# EAGLE design E-P-099-R2.8 (EAGLE 9.0.1)
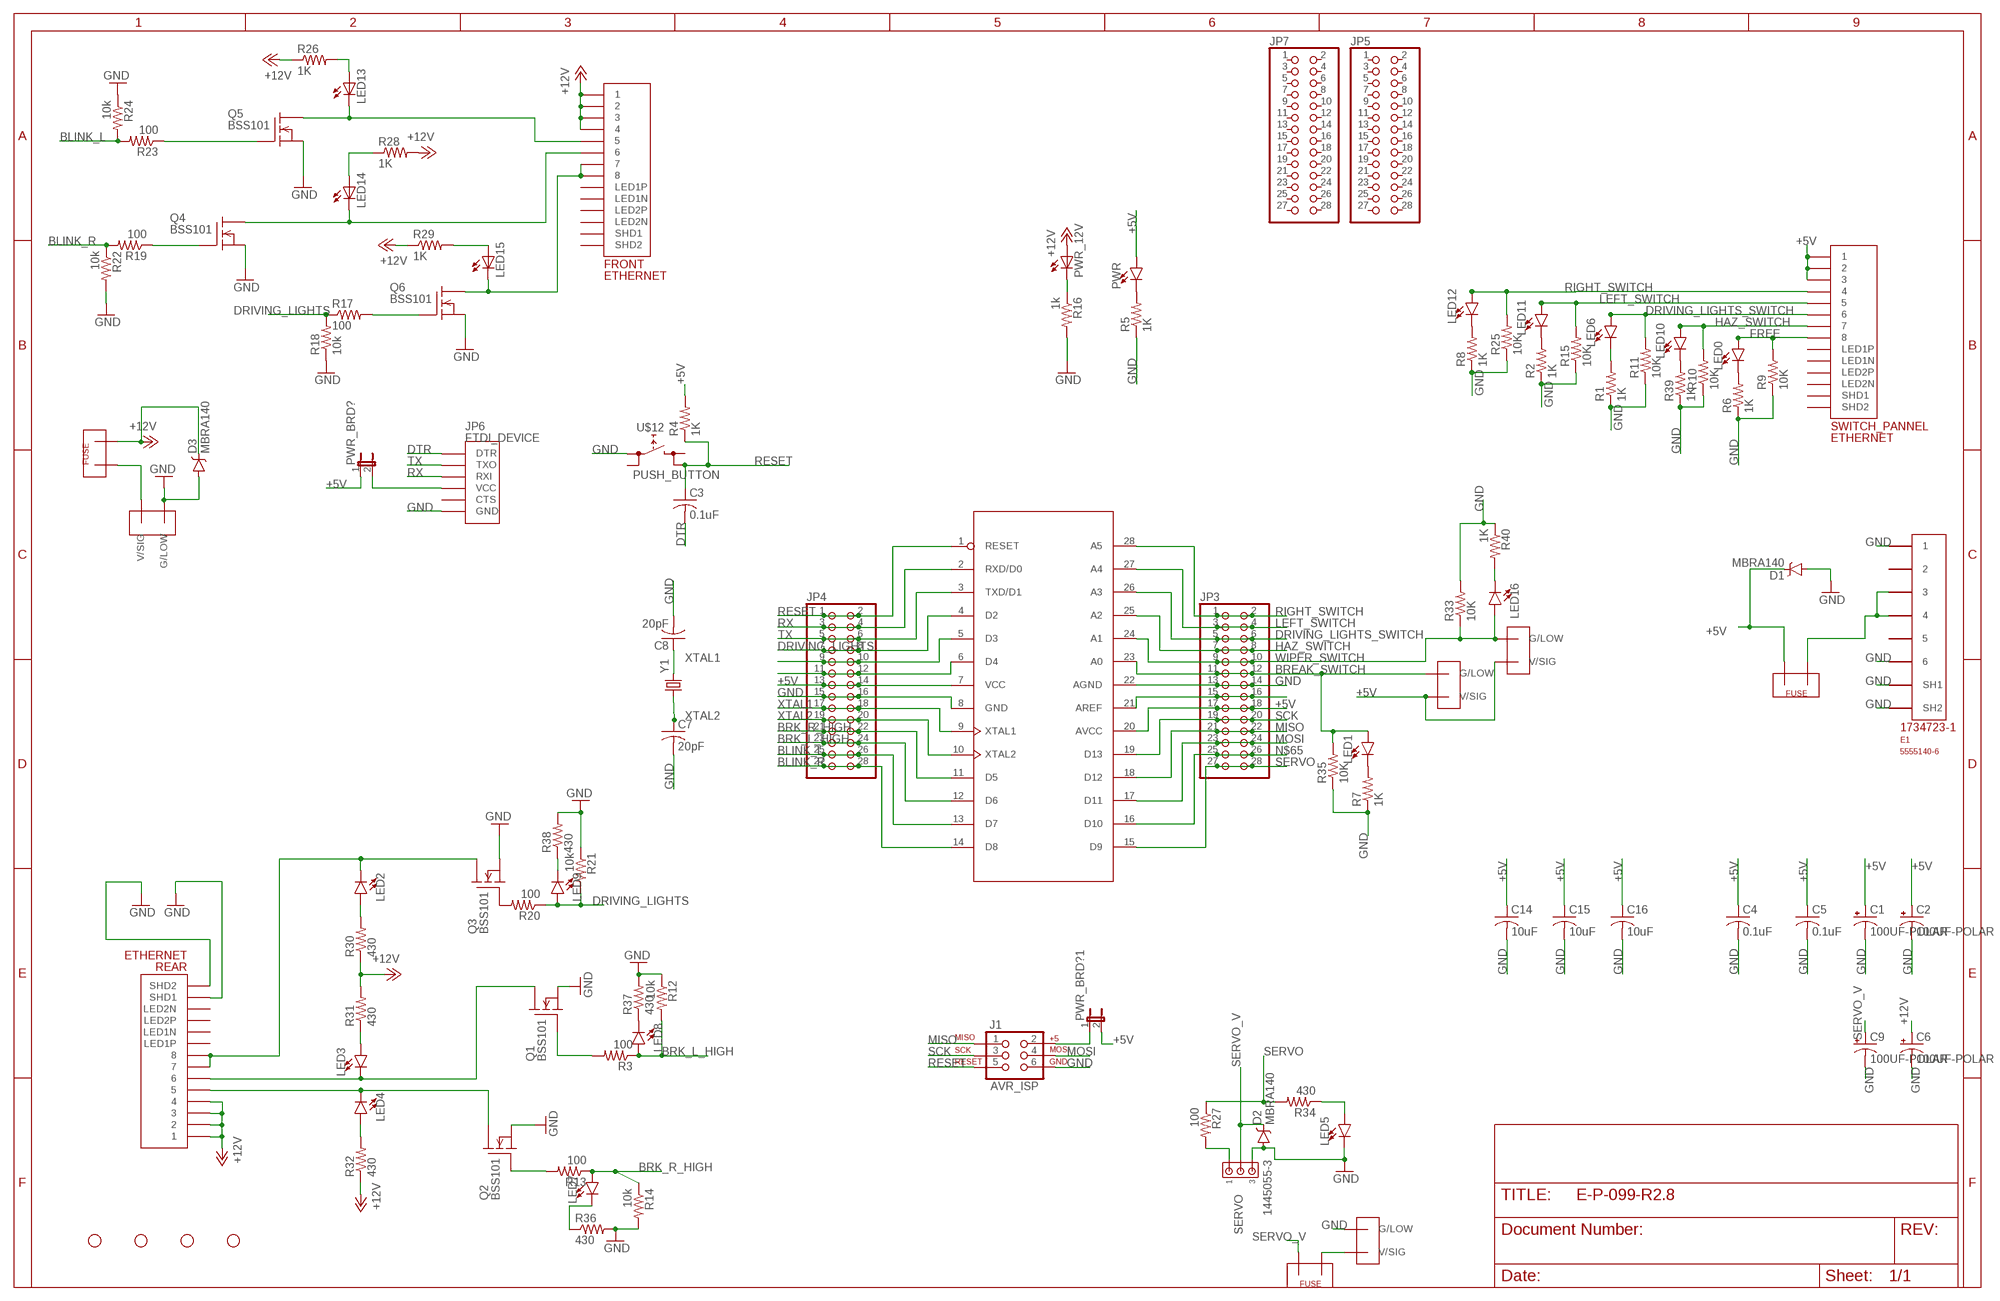
[diagram p0: schematic, sheet 1]

## Parts
C1  100UF-POLAR  [EEU-FR1H101]
C2  100UF-POLAR  [EEU-FR1H101]
C3  0.1uF  C-USC0805  [C0805]
C4  0.1uF  C-USC0805  [C0805]
C5  0.1uF  C-USC0805  [C0805]
C6  100UF-POLAR  [EEU-FR1H101]
C7  20pF  C-USC0805  [C0805]
C8  20pF  C-USC0805  [C0805]
C9  100UF-POLAR  [EEU-FR1H101]
C14  10uF  C-USC0805  [C0805]
C15  10uF  C-USC0805  [C0805]
C16  10uF  C-USC0805  [C0805]
D1  MBRA140  [SMA-DIODE]
D2  MBRA140  [SMA-DIODE]
D3  MBRA140  [SMA-DIODE]
E1  5555140-6  [1734723-1_RJ11]
FRONT  ETHERNET  [A122645-ND]
J1  AVR_ISP  AVR_SPI_PRG_6PTH  [2X3]
JP3  PINHD-2X14  [2X14]
JP4  PINHD-2X14  [2X14]
JP5  PINHD-2X14  [2X14]
JP6  FTDI_DEVICE  [FTDI_DEVICE_SIDE]
JP7  PINHD-2X14  [2X14]
LED0  LED0603  [LED-0603]
LED1  LED0603  [LED-0603]
LED2  LED0603  [LED-0603]
LED3  LED0603  [LED-0603]
LED4  LED0603  [LED-0603]
LED5  LED0603  [LED-0603]
LED6  LED0603  [LED-0603]
LED7  LED0603  [LED-0603]
LED8  LED0603  [LED-0603]
LED9  LED0603  [LED-0603]
LED10  LED0603  [LED-0603]
LED11  LED0603  [LED-0603]
LED12  LED0603  [LED-0603]
LED13  LEDCHIPLED_0805  [CHIPLED_0805]
LED14  LEDCHIPLED_0805  [CHIPLED_0805]
LED15  LEDCHIPLED_0805  [CHIPLED_0805]
LED16  LED0603  [LED-0603]
PWR  LED0603  [LED-0603]
PWR_12V  LEDCHIPLED_1206  [CHIPLED_1206]
PWR_BRD?  JP1E  [JP1]
PWR_BRD?1  JP1E  [JP1]
Q1  BSS101  [TO92]
Q2  BSS101  [TO92]
Q3  BSS101  [TO92]
Q4  BSS101  [TO92]
Q5  BSS101  [TO92]
Q6  BSS101  [TO92]
R1  1K  RESISTOR0805-RES  [0805]
R2  1K  RESISTOR0805-RES  [0805]
R3  100  RESISTOR0805-RES  [0805]
R4  1K  RESISTOR0805-RES  [0805]
R5  1K  RESISTOR0805-RES  [0805]
R6  1K  RESISTOR0805-RES  [0805]
R7  1K  RESISTOR0805-RES  [0805]
R8  1K  RESISTOR0805-RES  [0805]
R9  10K  R-US_R0805  [R0805]
R10  10K  R-US_R0805  [R0805]
R11  10K  R-US_R0805  [R0805]
R12  10k  RESISTOR0805-RES  [0805]
R13  100  RESISTOR0805-RES  [0805]
R14  10k  RESISTOR0805-RES  [0805]
R15  10K  R-US_R0805  [R0805]
R16  1k  RESISTOR0805-RES  [0805]
R17  100  RESISTOR0805-RES  [0805]
R18  10k  RESISTOR0805-RES  [0805]
R19  100  RESISTOR0805-RES  [0805]
R20  100  RESISTOR0805-RES  [0805]
R21  10k  RESISTOR0805-RES  [0805]
R22  10k  RESISTOR0805-RES  [0805]
R23  100  RESISTOR0805-RES  [0805]
R24  10k  RESISTOR0805-RES  [0805]
R25  10K  R-US_R0805  [R0805]
R26  1K  RESISTOR0805-RES  [0805]
R27  100  RESISTOR0805-RES  [0805]
R28  1K  RESISTOR0805-RES  [0805]
R29  1K  RESISTOR0805-RES  [0805]
R30  430  RESISTOR0805-RES  [0805]
R31  430  RESISTOR0805-RES  [0805]
R32  430  RESISTOR0805-RES  [0805]
R33  10K  R-US_R0805  [R0805]
R34  430  RESISTOR0805-RES  [0805]
R35  10K  R-US_R0805  [R0805]
R36  430  RESISTOR0805-RES  [0805]
R37  430  RESISTOR0805-RES  [0805]
R38  430  RESISTOR0805-RES  [0805]
R39  1K  RESISTOR0805-RES  [0805]
R40  1K  RESISTOR0805-RES  [0805]
REAR  ETHERNET  [A122645-ND]
SERVO  1445055-3  [1445055-3]
STANDOFF1  STAND-OFF  [STAND-OFF]
STANDOFF2  STAND-OFF  [STAND-OFF]
STANDOFF3  STAND-OFF  [STAND-OFF]
STANDOFF4  STAND-OFF  [STAND-OFF]
SWITCH_PANNEL  ETHERNET  [A122645-ND]
U$1  FUSEMINI-BLADE  [MINI-BLADE-FUSE]
U$2  FUSEMINI-BLADE  [MINI-BLADE-FUSE]
U$3  TE770966  [2X1-MATE-N-LOCK]
U$4  ATMEGA328  [DIP28-0.3IN]
U$5  TE770966  [2X1-MATE-N-LOCK]
U$6  TE770966  [2X1-MATE-N-LOCK]
U$8  TE770966  [2X1-MATE-N-LOCK]
U$9  FUSEMINI-BLADE  [MINI-BLADE-FUSE]
U$12  PUSH_BUTTON  [PUSHBUTTON]
Y1  CRYSTALHC49US  [HC49US]

## Nets
+5V: C1.P(+) C2.P(+) C4.1 C5.1 C14.1 C15.1 C16.1 D1.C JP3.17 JP3.18 JP4.13 JP4.14 PWR.A PWR_BRD?1.2 PWR_BRD?.1 R4.2 SWITCH_PANNEL.P$1 SWITCH_PANNEL.P$2 SWITCH_PANNEL.P$3 U$2.OUT U$3.CIRCUIT1(V/SIG) U$4.7(VCC) U$4.20(AVCC) U$5.CIRCUIT1(V/SIG)
+12V: C6.P(+) D3.C FRONT.P$1 FRONT.P$2 FRONT.P$3 FRONT.P$4 PWR_12V.A R26.1 R28.2 R29.1 R30.1 R31.2 R32.1 REAR.P$1 REAR.P$2 REAR.P$3 REAR.P$4 U$9.OUT
BLINK_L: JP4.25 JP4.26 R23.2 R24.2 U$4.13(D7)
BLINK_R: JP4.27 JP4.28 R19.2 R22.1 U$4.14(D8)
BREAK_SWITCH: JP3.11 JP3.12 LED1.A R35.2 U$3.CIRCUIT2(G/LOW) U$4.23(A0)
BRK_L_HIGH: JP4.23 JP4.24 LED8.A R3.1 R12.2 U$4.12(D6)
BRK_R_HIGH: JP4.21 JP4.22 LED7.A R13.1 R14.1 U$4.11(D5)
DRIVING_LIGHTS: JP4.7 JP4.8 LED9.A R17.1 R18.2 R20.1 R21.2 U$4.4(D2)
DRIVING_LIGHTS_SWITCH: JP3.5 JP3.6 LED6.A R11.2 SWITCH_PANNEL.P$6 U$4.26(A3)
DTR: C3.2 JP6.P$1(DTR)
FREE: LED0.A R9.2 SWITCH_PANNEL.P$8
GND: C1.G(-) C2.G(-) C4.2 C5.2 C6.G(-) C7.2 C8.2 C9.G(-) C14.2 C15.2 C16.2 D1.A D2.A D3.A E1.1 E1.6 E1.SH1 E1.SH2 J1.6 JP3.13 JP3.14 JP4.15 JP4.16 JP6.P$6(GND) LED5.C Q1.1(S) Q2.1(S) Q3.1(S) Q4.1(S) Q5.1(S) Q6.1(S) R1.1 R2.1 R5.1 R6.1 R7.1 R8.1 R9.1 R10.1 R11.1 R12.1 R14.2 R15.1 R16.2 R18.1 R21.1 R22.2 R24.1 R25.1 R33.2 R35.1 R36.2 R37.2 R38.2 R39.1 R40.1 REAR.P$13(SHD1) REAR.P$14(SHD2) SERVO.3 U$4.8(GND) U$4.22(AGND) U$6.CIRCUIT2(G/LOW) U$8.CIRCUIT2(G/LOW) U$12.L1(L)
HAZ_SWITCH: JP3.7 JP3.8 LED10.A R10.2 SWITCH_PANNEL.P$7 U$4.25(A2)
LEFT_SWITCH: JP3.3 JP3.4 LED11.A R15.2 SWITCH_PANNEL.P$5 U$4.27(A4)
MISO: J1.1 JP3.21 JP3.22 U$4.18(D12)
MOSI: J1.4 JP3.23 JP3.24 U$4.17(D11)
N$1: LED12.C R8.2
N$2: LED6.C R1.2
N$3: LED11.C R2.2
N$4: LED2.C Q3.3(D) REAR.P$7 REAR.P$8
N$5: LED3.C Q1.3(D) REAR.P$6
N$6: E1.3 E1.4 U$2.IN
N$7: LED4.C Q2.3(D) REAR.P$5
N$8: Q3.2(G) R20.2
N$9: JP6.P$4(VCC) PWR_BRD?.2
N$10: LED0.C R6.2
N$11: LED1.C R7.2
N$12: LED5.A R34.1
N$13: R27.2 SERVO.1
N$14: Q2.2(G) R13.2
N$15: Q1.2(G) R3.2
N$16: PWR_12V.C R16.1
N$17: Q5.2(G) R23.1
N$18: LED4.A R32.2
N$19: PWR.C R5.2
N$20: FRONT.P$7 FRONT.P$8 LED15.C Q6.3(D)
N$21: FRONT.P$6 LED14.C Q4.3(D)
N$22: FRONT.P$5 LED13.C Q5.3(D)
N$23: LED3.A R31.1
N$25: JP4.11 JP4.12 U$4.6(D4)
N$26: JP4.9 JP4.10 U$4.5(D3)
N$27: LED2.A R30.2
N$28: LED16.C R40.2
N$29: U$1.IN U$6.CIRCUIT1(V/SIG)
N$32: LED13.A R26.2
N$33: Q4.2(G) R19.1
N$34: LED14.A R28.1
N$35: Q6.2(G) R17.2
N$36: LED15.A R29.2
N$37: J1.2 PWR_BRD?1.1
N$41: LED7.C R36.1
N$42: LED8.C R37.1
N$44: LED9.C R38.1
N$46: LED10.C R39.2
N$47: U$8.CIRCUIT1(V/SIG) U$9.IN
N$60: JP3.15 JP3.16 U$4.21(AREF)
N$65: JP3.25 JP3.26 U$4.16(D10)
RESET: C3.1 J1.5 JP4.1 JP4.2 R4.1 U$4.1(RESET) U$12.R2(R)
RIGHT_SWITCH: JP3.1 JP3.2 LED12.A R25.2 SWITCH_PANNEL.P$4 U$4.28(A5)
RX: JP4.3 JP4.4 JP6.P$3(RXI) U$4.2(RXD/D0)
SCK: J1.3 JP3.19 JP3.20 U$4.19(D13)
SERVO: JP3.27 JP3.28 R27.1 R34.2 U$4.15(D9)
SERVO_V: C9.P(+) D2.C SERVO.2 U$1.OUT
TX: JP4.5 JP4.6 JP6.P$2(TXO) U$4.3(TXD/D1)
WIPER_SWITCH: JP3.9 JP3.10 LED16.A R33.1 U$4.24(A1) U$5.CIRCUIT2(G/LOW)
XTAL1: C8.1 JP4.17 JP4.18 U$4.9(XTAL1) Y1.2
XTAL2: C7.1 JP4.19 JP4.20 U$4.10(XTAL2) Y1.1
Unconnected: E1.2 E1.5 FRONT.P$9(LED1N) FRONT.P$10(LED1P) FRONT.P$11(LED2N) FRONT.P$12(LED2P) FRONT.P$13(SHD1) FRONT.P$14(SHD2) JP5.1 JP5.2 JP5.3 JP5.4 JP5.5 JP5.6 JP5.7 JP5.8 JP5.9 JP5.10 JP5.11 JP5.12 JP5.13 JP5.14 JP5.15 JP5.16 JP5.17 JP5.18 JP5.19 JP5.20 JP5.21 JP5.22 JP5.23 JP5.24 JP5.25 JP5.26 JP5.27 JP5.28 JP6.P$5(CTS) JP7.1 JP7.2 JP7.3 JP7.4 JP7.5 JP7.6 JP7.7 JP7.8 JP7.9 JP7.10 JP7.11 JP7.12 JP7.13 JP7.14 JP7.15 JP7.16 JP7.17 JP7.18 JP7.19 JP7.20 JP7.21 JP7.22 JP7.23 JP7.24 JP7.25 JP7.26 JP7.27 JP7.28 REAR.P$9(LED1N) REAR.P$10(LED1P) REAR.P$11(LED2N) REAR.P$12(LED2P) SWITCH_PANNEL.P$9(LED1N) SWITCH_PANNEL.P$10(LED1P) SWITCH_PANNEL.P$11(LED2N) SWITCH_PANNEL.P$12(LED2P) SWITCH_PANNEL.P$13(SHD1) SWITCH_PANNEL.P$14(SHD2) U$12.L2(L) U$12.R1(R)

## Library data of the parts
C1 C2 C6 C9 = 100uF_Cap:100UF-POLAR: 100µF polarized capacitors A capacitor is a passive two-terminal electrical component used to store electrical energy temporarily in an electric field.
C3-C5 C7 C8 C14-C16 = adafruit:C-US: CAPACITOR, American symbol
D1-D3 = SparkFun-DiscreteSemi:MBRA140: 40V, 1A Schottky rectifier SMA/DO-214AC package DIO-08053; PROD_ID: DIO-08053
E1 = 5555140-6 RJ11:5555140-6
FRONT REAR SWITCH_PANNEL = ETHERNET-3:ETHERNET: Ethernet port with 2 leds. digikey number A122645-ND
J1 = E-P-099-R2.2:AVR_SPI_PRG_6: AVR ISP 6 Pin This is the reduced ISP connector for AVR programming. Common on Arduino. This footprint will take up less PCB space and can be used with a 10-pin to 6-pin adapter such as SKU: BOB-08508
JP3-JP5 JP7 = E-P-099-R2.2:PINHD-2X14: PIN HEADER
JP6 = SparkFun-Connectors:FTDI_DEVICE: Connector which mates to FTDI basic or FTDI cable.
LED0 LED1-LED12 LED16 PWR = SparkFun-LED:LED: LED (Generic) Standard schematic elements and footprints for 5mm, 3mm, 1206, and 0603 sized LEDs. Generic LEDs with no color specified.
LED13-LED15 = led:LED: LED OSRAM: - CHIPLED LG R971, LG N971, LY N971, LG Q971, LY Q971, LO R971, LY R971 LH N974, LH R974 LS Q976, LO Q976, LY Q976 LO Q996 - Hyper CHIPLED LW Q18S LB Q993, LB Q99A, LB R99A - SideLED LS A670, LO A670, LY A670, LG A670, LP A670 LB A673, LV A673, LT A673, LW A673 LH A674 LY A675 LS A676, LA A676, LO A676, LY A676, LW A676 LS A679, LY A679, LG A679 - Hyper Micro SIDELED® LS Y876, LA Y876, LO Y876, LY Y876 LT Y87S - SmartLED LW L88C, LW L88S LB L89C, LB L89S, LG L890 LS L89K, LO L89K, LY L89K LS L896, LA L896, LO L896, LY L896 - TOPLED LS T670, LO T670, LY T670, LG T670, LP T670 LSG T670, LSP T670, LSY T670, LOP T670, LYG T670 LG T671, LOG T671, LSG T671 LB T673, LV T673, LT T673, LW T673 LH T674 LS T676, LA T676, LO T676, LY T676, LB T676, LH T676, LSB T676, LW T676 LB T67C, LV T67C, LT T67C, LS T67K, LO T67K, LY T67K, LW E67C LS E67B, LA E67B, LO E67B, LY E67B, LB E67C, LV E67C, LT E67C LW T67C LS T679, LY T679, LG T679 LS T770, LO T770, LY T770, LG T770, LP T770 LB T773, LV T773, LT T773, LW T773 LH T774 LS E675, LA E675, LY E675, LS T675 LS T776, LA T776, LO T776, LY T776, LB T776 LHGB T686 LT T68C, LB T68C - Hyper Mini TOPLED® LB M676 - Mini TOPLED Santana® LG M470 LS M47K, LO M47K, LY M47K Source: http://www.osram.convergy.de LUXEON: - LUMILED® LXK2-PW12-R00, LXK2-PW12-S00, LXK2-PW14-U00, LXK2-PW14-V00 LXK2-PM12-R00, LXK2-PM12-S00, LXK2-PM14-U00 LXK2-PE12-Q00, LXK2-PE12-R00, LXK2-PE12-S00, LXK2-PE14-T00, LXK2-PE14-U00 LXK2-PB12-K00, LXK2-PB12-L00, LXK2-PB12-M00, LXK2-PB14-N00, LXK2-PB14-P00, LXK2-PB14-Q00 LXK2-PR12-L00, LXK2-PR12-M00, LXK2-PR14-Q00, LXK2-PR14-R00 LXK2-PD12-Q00, LXK2-PD12-R00, LXK2-PD12-S00 LXK2-PH12-R00, LXK2-PH12-S00 LXK2-PL12-P00, LXK2-PL12-Q00, LXK2-PL12-R00 Source: www.luxeon.com KINGBRIGHT: KA-3528ASYC Source: www.kingbright.com
PWR_12V = E14-P-099-R21.2(US_drills):LED: LED OSRAM: - CHIPLED LG R971, LG N971, LY N971, LG Q971, LY Q971, LO R971, LY R971 LH N974, LH R974 LS Q976, LO Q976, LY Q976 LO Q996 - Hyper CHIPLED LW Q18S LB Q993, LB Q99A, LB R99A - SideLED LS A670, LO A670, LY A670, LG A670, LP A670 LB A673, LV A673, LT A673, LW A673 LH A674 LY A675 LS A676, LA A676, LO A676, LY A676, LW A676 LS A679, LY A679, LG A679 - Hyper Micro SIDELED® LS Y876, LA Y876, LO Y876, LY Y876 LT Y87S - SmartLED LW L88C, LW L88S LB L89C, LB L89S, LG L890 LS L89K, LO L89K, LY L89K LS L896, LA L896, LO L896, LY L896 - TOPLED LS T670, LO T670, LY T670, LG T670, LP T670 LSG T670, LSP T670, LSY T670, LOP T670, LYG T670 LG T671, LOG T671, LSG T671 LB T673, LV T673, LT T673, LW T673 LH T674 LS T676, LA T676, LO T676, LY T676, LB T676, LH T676, LSB T676, LW T676 LB T67C, LV T67C, LT T67C, LS T67K, LO T67K, LY T67K, LW E67C LS E67B, LA E67B, LO E67B, LY E67B, LB E67C, LV E67C, LT E67C LW T67C LS T679, LY T679, LG T679 LS T770, LO T770, LY T770, LG T770, LP T770 LB T773, LV T773, LT T773, LW T773 LH T774 LS E675, LA E675, LY E675, LS T675 LS T776, LA T776, LO T776, LY T776, LB T776 LHGB T686 LT T68C, LB T68C - Hyper Mini TOPLED® LB M676 - Mini TOPLED Santana® LG M470 LS M47K, LO M47K, LY M47K Source: http://www.osram.convergy.de LUXEON: - LUMILED® LXK2-PW12-R00, LXK2-PW12-S00, LXK2-PW14-U00, LXK2-PW14-V00 LXK2-PM12-R00, LXK2-PM12-S00, LXK2-PM14-U00 LXK2-PE12-Q00, LXK2-PE12-R00, LXK2-PE12-S00, LXK2-PE14-T00, LXK2-PE14-U00 LXK2-PB12-K00, LXK2-PB12-L00, LXK2-PB12-M00, LXK2-PB14-N00, LXK2-PB14-P00, LXK2-PB14-Q00 LXK2-PR12-L00, LXK2-PR12-M00, LXK2-PR14-Q00, LXK2-PR14-R00 LXK2-PD12-Q00, LXK2-PD12-R00, LXK2-PD12-S00 LXK2-PH12-R00, LXK2-PH12-S00 LXK2-PL12-P00, LXK2-PL12-Q00, LXK2-PL12-R00 Source: www.luxeon.com KINGBRIGHT: KA-3528ASYC Source: www.kingbright.com
PWR_BRD? PWR_BRD?1 = E-P-099-R2.2:JP1E: JUMPER
Q1-Q6 = transistor-fet:BSS101: N-Channel Enhancement MOSFET 200V; 0,16A; 11Ohm
R1-R8 R12-R14 R16-R24 R26-R32 R34 R36-R40 = SparkFun-Passives:RESISTOR: Resistor Basic schematic elements and footprints for 0603, 1206, and PTH resistors.
R9-R11 R15 R25 R33 R35 = resistor:R-US_: RESISTOR, American symbol
SERVO = con-amp:1445055-3: Micro MATE-N-LOK Connectors grid 1.5 mm Source: ENG_CD_1445055_A.pdf
STANDOFF1-STANDOFF4 = SparkFun-Electromechanical:STAND-OFF: #4 Stand Off This is the mechanical footprint for a #4 phillips button head screw. Use the keepout ring to avoid running the screw head into surrounding components. SKU : PRT-00447
U$1 U$2 U$9 = Shell2013:FUSE
U$3 U$5 U$6 U$8 = Shell2013(1):TE770966
U$4 = E-P-099-R2.2:ATMEGA328
U$12 = E-P-099-R2.2:PUSH_BUTTON
Y1 = SparkFun-FreqCtrl:CRYSTAL: Various standard crystals. Proven footprints.

## Board
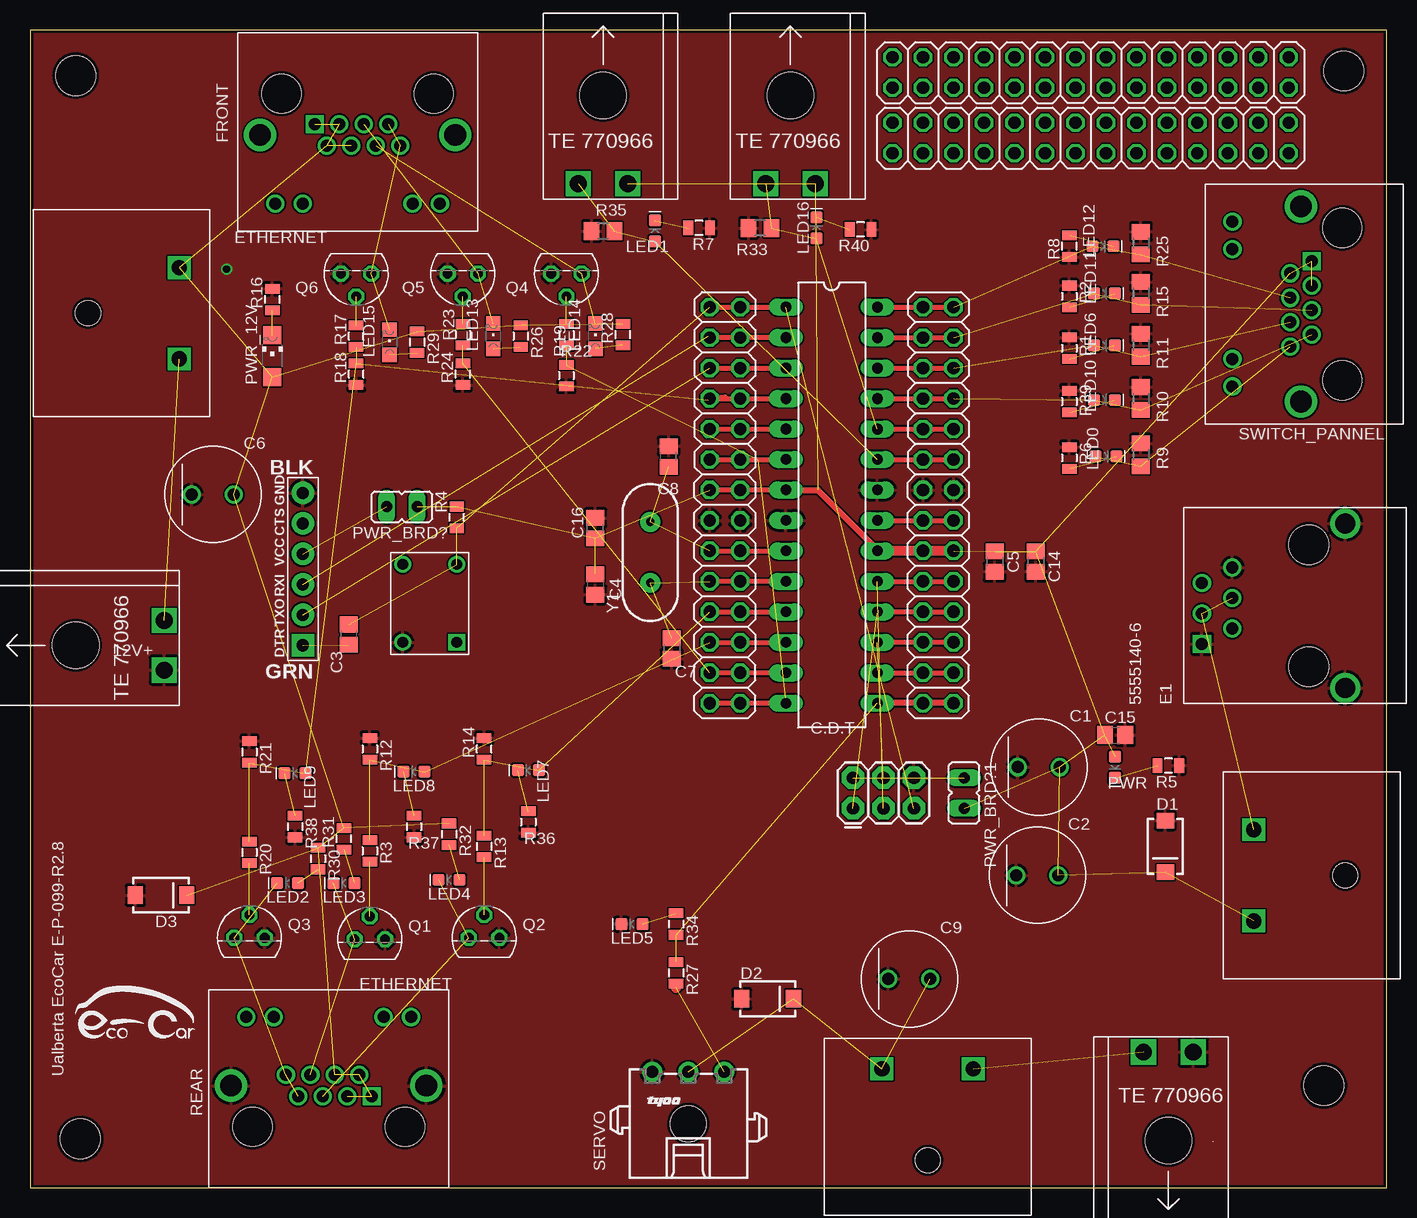
[diagram p1: board, top side]
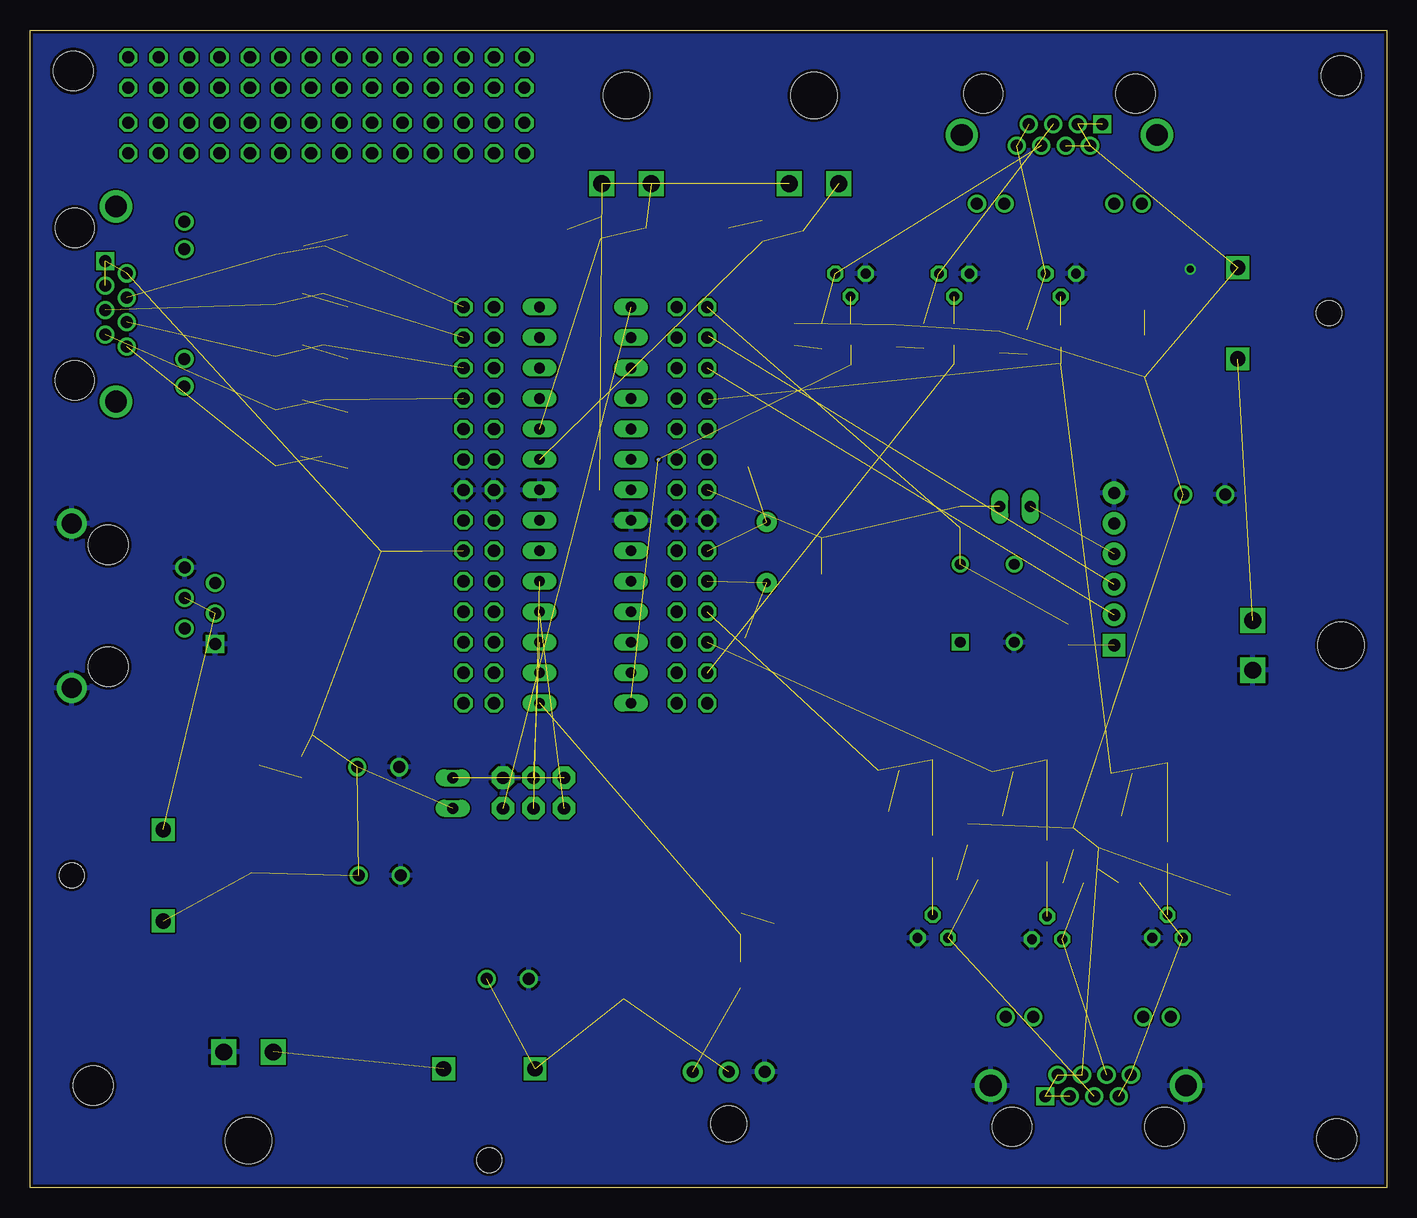
[diagram p2: board, bottom side, seen from below]

Size 113.08 x 96.51 mm. Coordinates in mm from the lower left corner, seen from the top.
Outline: 0,0 113.08,0 113.08,96.51 0,96.51 0,0
Copper layers (1*16): Top 0.035mm / dielectric 1.5mm / Bottom 0.035mm
Design rules "SeeedStudio_2layer_DRU_no_angle_20140221": minimum track width 6mil, minimum drill 12mil, track to track 6mil, track to pad 6mil, pad to pad 6mil, via to via 6mil, smd to smd 0mil, copper to edge 10mil, drill to drill 10mil, minimum pad ring 10mil, minimum via ring 6mil, stop-mask expansion 2mil, vias tented up to drill 100mil, thermal gap 10mil

### Footprints (pad centres in the part's own frame; a part is rotated, then mirrored left to right if it is on the bottom)
EEU-FR1H101 = drill 1: G -1.75,0; P 1.75,0
C0805 = smd 1.3 x 1.5: 1 -0.85,0; 2 0.85,0
SMA-DIODE = smd 1.27 x 1.47: A -2.15,0; C 2.15,0
1734723-1_RJ11 = drill 1 square: 1 -3.81,2.54 | drill 1: 2 -2.54,0; 3 -1.27,2.54; 4 0,0; 5 1.27,2.54; 6 2.54,0 | drill 1.65: SH1 -7.5,-9.4; SH2 6.22,-9.4 | hole 3.3: -5.72,-6.35; 4.44,-6.35
A122645-ND = drill 1 square: P$1 3.58,2.54 | drill 1: P$2 2.56,4.32; P$3 1.54,2.54; P$4 0.52,4.32; P$5 -0.5,2.54; P$6 -1.52,4.32; P$7 -2.54,2.54; P$8 -3.56,4.32; P$9 -6.86,9.14; P$10 -4.57,9.14; P$11 4.57,9.14; P$12 6.86,9.14 | drill 1.8: P$13 -8.13,3.43; P$14 8.13,3.43 | hole 3.25: -6.35,0; 6.35,0
2X3 = drill 1.016 pad 1.88 octagon: 1 0,0; 2 0,2.54; 3 2.54,0; 4 2.54,2.54; 5 5.08,0; 6 5.08,2.54
2X14 = drill 1.016 octagon: 1 -16.51,-1.27; 2 -16.51,1.27; 3 -13.97,-1.27; 4 -13.97,1.27; 5 -11.43,-1.27; 6 -11.43,1.27; 7 -8.89,-1.27; 8 -8.89,1.27; 9 -6.35,-1.27; 10 -6.35,1.27; 11 -3.81,-1.27; 12 -3.81,1.27; 13 -1.27,-1.27; 14 -1.27,1.27; 15 1.27,-1.27; 16 1.27,1.27; 17 3.81,-1.27; 18 3.81,1.27; 19 6.35,-1.27; 20 6.35,1.27; 21 8.89,-1.27; 22 8.89,1.27; 23 11.43,-1.27; 24 11.43,1.27; 25 13.97,-1.27; 26 13.97,1.27; 27 16.51,-1.27; 28 16.51,1.27
FTDI_DEVICE_SIDE = drill 1.016 pad 1.88 square: P$1 -6.35,0 | drill 1.016 pad 1.88: P$2 -3.81,0; P$3 -1.27,0; P$4 1.27,0; P$5 3.81,0; P$6 6.35,0
LED-0603 = smd 1 x 1: A -0.877,0; C 0.877,0
CHIPLED_0805 = smd 1.2 x 1.2: A 0,-1.05; C 0,1.05
CHIPLED_1206 = smd 1.5 x 1.5: A 0,-1.75; C 0,1.75
JP1 = drill 0.914 long: 1 0,-1.27; 2 0,1.27
TO92 = drill 0.813 octagon: 1 1.27,0; 2 0,1.905; 3 -1.27,0
0805 = smd 0.8 x 1.2: 1 -0.9,0; 2 0.9,0
R0805 = smd 1.3 x 1.5: 1 -0.95,0; 2 0.95,0
1445055-3 = drill 1 pad 1.676: 1 3,4.32; 2 0,4.32; 3 -3,4.32 | hole 3: 0,0
STAND-OFF = hole 3.302: 0,0
MINI-BLADE-FUSE = drill 1.27 square: IN 3.81,7.62; OUT -3.81,7.62 | hole 2.083: 0,0
2X1-MATE-N-LOCK = drill 1.4 square: CIRCUIT1 -2.07,14.23; CIRCUIT2 2.07,14.23 | hole 3.86: 0,6.86
DIP28-0.3IN = drill 0.889 long: 1 -16.51,-3.81; 2 -13.97,-3.81; 3 -11.43,-3.81; 4 -8.89,-3.81; 5 -6.35,-3.81; 6 -3.81,-3.81; 7 -1.27,-3.81; 8 1.27,-3.81; 9 3.81,-3.81; 10 6.35,-3.81; 11 8.89,-3.81; 12 11.43,-3.81; 13 13.97,-3.81; 14 16.51,-3.81; 15 16.51,3.81; 16 13.97,3.81; 17 11.43,3.81; 18 8.89,3.81; 19 6.35,3.81; 20 3.81,3.81; 21 1.27,3.81; 22 -1.27,3.81; 23 -3.81,3.81; 24 -6.35,3.81; 25 -8.89,3.81; 26 -11.43,3.81; 27 -13.97,3.81; 28 -16.51,3.81
PUSHBUTTON = drill 0.889: L1 0,4.5; R1 6.5,4.5; R2 6.5,0 | drill 0.889 square: L2 0,0
HC49US = drill 0.7 pad 1.651: 1 -2.54,0; 2 2.54,0

### Placement (x,y rotation side)
C1  84.07,35.05 0 top
C2  83.95,26.03 0 top
C3  26.54,46.1 270 top
C4  47.12,50.29 270 top
C5  80.39,52.2 270 top
C6  15.24,57.78 0 top
C7  53.47,44.96 270 top
C8  53.21,60.96 90 top
C9  73.28,17.4 0 top
C14  83.82,52.2 270 top
C15  90.42,37.72 0 top
C16  47.12,54.99 90 top
D1  94.62,28.45 270 top
D2  61.47,15.75 0 top
D3  10.92,24.38 0 top
E1  100.2,49.15 90 top
FRONT  27.3,91.19 180 top
J1  68.58,31.62 0 top
JP3  75.69,56.9 270 top
JP4  57.91,56.9 270 top
JP5  88.39,87.5 0 top
JP6  22.73,51.56 90 top
JP7  88.39,92.96 0 top
LED0  89.66,60.96 0 top
LED1  52.07,79.76 90 top
LED2  21.46,25.4 180 top
LED3  26.16,25.4 180 top
LED4  34.92,25.65 180 top
LED5  50.16,21.97 180 top
LED6  89.53,70.23 0 top
LED7  41.53,34.8 180 top
LED8  32,34.67 180 top
LED9  22.1,34.54 180 top
LED10  89.53,65.66 0 top
LED11  89.53,74.55 0 top
LED12  89.41,78.49 0 top
LED13  38.61,70.99 0 top
LED14  47.12,70.99 0 top
LED15  29.97,70.48 0 top
LED16  65.53,80.01 90 top
PWR  90.42,35.05 270 top
PWR_12V  20.19,69.34 0 top
PWR_BRD?  30.99,56.77 90 top
PWR_BRD?1  77.85,32.89 180 top
Q1  28.32,20.7 0 top
Q2  37.85,20.83 0 top
Q3  18.29,20.83 0 top
Q4  44.7,76.2 180 top
Q5  36.07,76.2 180 top
Q6  27.18,76.2 180 top
R1  86.61,69.98 270 top
R2  86.61,74.3 270 top
R3  28.32,28.07 270 top
R4  35.56,55.88 90 top
R5  94.87,35.18 180 top
R6  86.61,60.83 270 top
R7  55.75,80.01 180 top
R8  86.61,78.49 90 top
R9  92.58,61.09 270 top
R10  92.58,65.79 270 top
R11  92.58,70.23 270 top
R12  28.32,36.58 270 top
R13  37.85,28.45 270 top
R14  37.85,36.58 90 top
R15  92.58,74.55 270 top
R16  20.19,74.04 90 top
R17  27.18,70.99 90 top
R18  27.18,67.82 90 top
R19  44.7,71.12 270 top
R20  18.29,27.94 270 top
R21  18.29,36.32 270 top
R22  44.7,67.69 270 top
R23  36.07,71.12 270 top
R24  36.07,67.82 90 top
R25  92.58,78.74 270 top
R26  40.89,70.99 270 top
R27  53.85,17.91 270 top
R28  49.4,71.12 90 top
R29  32.26,70.48 270 top
R30  24,27.43 270 top
R31  26.16,29.08 90 top
R32  34.92,29.46 270 top
R33  60.83,80.01 180 top
R34  53.85,21.97 270 top
R35  47.75,79.76 0 top
R36  41.53,30.48 270 top
R37  32,30.1 270 top
R38  22.1,30.1 270 top
R39  86.61,65.53 270 top
R40  69.22,79.88 180 top
REAR  24.89,5.08 0 top
SERVO  54.86,5.33 0 top
STANDOFF1  107.82,8.51 0 top
STANDOFF2  109.47,93.09 0 top
STANDOFF3  4.19,4.06 0 top
STANDOFF4  3.81,92.71 0 top
SWITCH_PANNEL  109.35,73.66 90 top
U$1  74.8,2.29 0 top
U$2  109.6,26.03 90 top
U$3  47.75,97.92 180 top
U$4  66.8,56.9 270 top
U$5  63.37,97.92 180 top
U$6  94.87,-2.92 0 top
U$8  -3.05,45.21 270 top
U$9  4.83,72.9 270 top
U$12  35.56,45.47 90 top
Y1  51.69,52.96 90 top

### Tracks (layer width: path | path; a pad name or v marks a point on that pad's centre or on a via)
+5V  (18 unrouted)
  Top 0.406: U$4.7 JP4.14 JP4.13
  Top 0.508: U$4.7 65.66,58.17 70.74,53.09
  Top 0.813: JP3.18 JP3.17 70.74,53.09 U$4.20
  Bottom 0.406: 69.47,53.34 U$4.20
+12V  (17 unrouted)
BLINK_L  (2 unrouted)
  Top 0.406: U$4.13 JP4.26 JP4.25
BLINK_R  (3 unrouted)
  Top 0.305: U$4.14 62.99,40.81
  Top 0.406: JP4.27 JP4.28 U$4.14
  Bottom 0.305: 60.71,60.71 60.69,60.71
BREAK_SWITCH  (3 unrouted)
  Top 0.406: U$4.23 JP3.11 JP3.12
BRK_L_HIGH  (3 unrouted)
  Top 0.406: JP4.23 JP4.24 U$4.12
BRK_R_HIGH  (3 unrouted)
  Top 0.406: JP4.21 JP4.22 U$4.11
DRIVING_LIGHTS  (5 unrouted)
  Top 0.406: 57.91,65.91 JP4.7 JP4.8 U$4.4
  Bottom 0.305: 56.52,65.66 JP4.7
DRIVING_LIGHTS_SWITCH  (3 unrouted)
  Top 0.406: U$4.26 JP3.5 JP3.6
DTR  (1 unrouted)
FREE  (2 unrouted)
GND  (via drill 0.6)
  other vias: 16.38,76.58
  pour Bottom (rank 5): 0,96.52 113.03,96.52 113.03,0 0,0
  pour Top: -2.41,-1.65 -2.41,99.69 114.05,99.69 114.17,99.82 114.17,-1.65 114.05,-1.78 -2.29,-1.78
HAZ_SWITCH  (3 unrouted)
  Top 0.406: U$4.25 JP3.7 JP3.8
LEFT_SWITCH  (3 unrouted)
  Top 0.406: U$4.27 JP3.3 JP3.4
MISO  (1 unrouted)
  Top 0.305: 70.61,47.88 U$4.18
  Top 0.406: JP3.22 JP3.21 U$4.18
MOSI  (1 unrouted)
  Top 0.406: JP3.24 JP3.23 U$4.17
N$1  (1 unrouted)
N$2  (1 unrouted)
N$3  (1 unrouted)
N$4  (3 unrouted)
N$5  (2 unrouted)
N$6  (2 unrouted)
N$7  (2 unrouted)
N$8  (1 unrouted)
N$9  (1 unrouted)
N$10  (1 unrouted)
N$11  (1 unrouted)
N$12  (1 unrouted)
  Top 0.508: 53.83,22.85 R34.1
N$13  (1 unrouted)
  Top 0.813: 53.85,16.64 R27.2
N$14  (1 unrouted)
N$15  (1 unrouted)
N$16  (1 unrouted)
N$17  (1 unrouted)
N$18  (1 unrouted)
N$19  (1 unrouted)
N$20  (3 unrouted)
N$21  (2 unrouted)
N$22  (2 unrouted)
N$23  (1 unrouted)
N$25
  Top 0.406: JP4.11 JP4.12 U$4.6
N$26
  Top 0.406: JP4.9 JP4.10 U$4.5
N$27  (1 unrouted)
N$28  (1 unrouted)
N$29  (1 unrouted)
N$32  (1 unrouted)
N$33  (1 unrouted)
N$34  (1 unrouted)
N$35  (1 unrouted)
N$36  (1 unrouted)
N$37  (1 unrouted)
N$41  (1 unrouted)
N$42  (1 unrouted)
N$44  (1 unrouted)
N$46  (1 unrouted)
N$47  (1 unrouted)
N$60
  Top 0.406: U$4.21 JP3.15 JP3.16
N$65
  Top 0.406: U$4.16 JP3.25 JP3.26
RESET  (4 unrouted)
  Top 0.406: JP4.1 JP4.2 U$4.1
RIGHT_SWITCH  (3 unrouted)
  Top 0.406: U$4.28 JP3.1 JP3.2
RX  (1 unrouted)
  Top 0.406: U$4.2 JP4.4 JP4.3
  Bottom 0.305: 56.52,70.99 JP4.3
SCK  (1 unrouted)
  Top 0.406: U$4.19 JP3.19 JP3.20
SERVO  (2 unrouted)
  Top 0.508: JP3.28 JP3.27 U$4.15
SERVO_V  (3 unrouted)
TX  (1 unrouted)
  Top 0.406: JP4.5 JP4.6 U$4.3
WIPER_SWITCH  (3 unrouted)
  Top 0.406: U$4.24 JP3.9 JP3.10
XTAL1  (2 unrouted)
  Top 0.406: JP4.17 JP4.18 U$4.9
  Bottom 0.305: 62.56,53.09 U$4.9
XTAL2  (2 unrouted)
  Top 0.406: U$4.10 JP4.20 JP4.19

### Text on the board
tPlace: 12V+ | C.D.T | Ualberta EcoCar E-P-099-R2.8